# Altium schematic sheet GD_Tcontroller.SchDoc
size A4
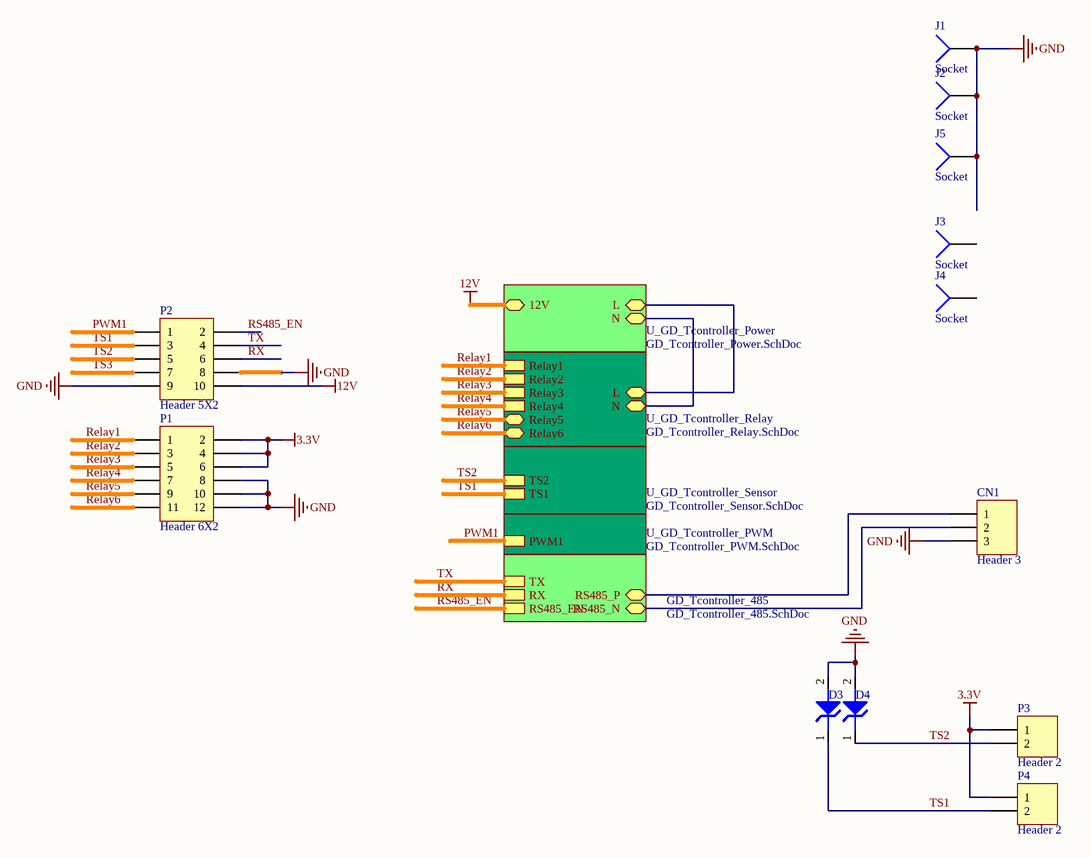
[diagram p0: GD_Tcontroller.SchDoc]

## Parts
CN1  Header 3  [HT5.08-3P-H]
D3  SMAJ5.0A  [SMA]  (value not drawn)
D4  SMAJ5.0A  [SMA]  (value not drawn)
J1  Socket  [SCREWFG3_2]
J2  Socket  [SCREWFG3_2]
J3  Socket  [SCREWFG3_2]
J4  Socket  [SCREWFG3_2]
J5  Socket  [SCREWFG3_2]
P1  Header 6X2  [DC3-12P]
P2  Header 5X2  [DC3-10P]
P3  Header 2  [PH2.0-2P-H]
P4  Header 2  [PH2.0-2P-H]

## Sub-sheets
GD_Tcontroller_485 = GD_Tcontroller_485.SchDoc: RS485_EN, TX, RX, RS485_P, RS485_N
U_GD_Tcontroller_Power = GD_Tcontroller_Power.SchDoc: N, L, 12V
U_GD_Tcontroller_PWM = GD_Tcontroller_PWM.SchDoc: PWM1
U_GD_Tcontroller_Relay = GD_Tcontroller_Relay.SchDoc: Relay1, Relay2, Relay3, Relay4, Relay5, Relay6, L, N
U_GD_Tcontroller_Sensor = GD_Tcontroller_Sensor.SchDoc: TS1, TS2

## Nets
3.3V: P1.2 P1.4 P1.6 P3.1 P4.1
12V: P2.10 ; sheet U_GD_Tcontroller_Power/12V
GND: CN1.3 D3.2 D4.2 J1.1 J2.1 J5.1 P1.8 P1.10 P1.12 P2.8 P2.9
PWM1: P2.1 ; sheet U_GD_Tcontroller_PWM/PWM1
Relay1: P1.1 ; sheet U_GD_Tcontroller_Relay/Relay1
Relay2: P1.3 ; sheet U_GD_Tcontroller_Relay/Relay2
Relay3: P1.5 ; sheet U_GD_Tcontroller_Relay/Relay3
Relay4: P1.7 ; sheet U_GD_Tcontroller_Relay/Relay4
Relay5: P1.9 ; sheet U_GD_Tcontroller_Relay/Relay5
Relay6: P1.11 ; sheet U_GD_Tcontroller_Relay/Relay6
RS485_EN: P2.2 ; sheet GD_Tcontroller_485/RS485_EN
RX: P2.6 ; sheet GD_Tcontroller_485/RX
TS1: D3.1 P2.3 P4.2 ; sheet U_GD_Tcontroller_Sensor/TS1
TS2: D4.1 P2.5 P3.2 ; sheet U_GD_Tcontroller_Sensor/TS2
TS3: P2.7
TX: P2.4 ; sheet GD_Tcontroller_485/TX
NetCN1_1: CN1.1 ; sheet GD_Tcontroller_485/RS485_P
NetCN1_2: CN1.2 ; sheet GD_Tcontroller_485/RS485_N
(unnamed): sheet U_GD_Tcontroller_Relay/L, sheet U_GD_Tcontroller_Power/L
(unnamed): sheet U_GD_Tcontroller_Relay/N, sheet U_GD_Tcontroller_Power/N

Not connected (* = marked no-connect by the designer): J3 1; J4 1

## Library data of the parts
CN1 = Header 3: Header, 3-Pin; LatestRevisionDate: 17-Jul-2002; LatestRevisionNote: Re-released for DXP Platform.; Publisher: Altium Limited
D3 D4 = ED00032: Manufacturer P/N: SMBJ15A; Manufacturer: Bourns; P/N: EE00002; Value: SMBJ15A; Type: ****
P1 = Header 6X2: Header, 6-Pin, Dual row; LatestRevisionDate: 17-Jul-2002; LatestRevisionNote: Re-released for DXP Platform.; Publisher: Altium Limited
P2 = Header 5X2: Header, 5-Pin, Dual row; LatestRevisionDate: 17-Jul-2002; LatestRevisionNote: Re-released for DXP Platform.; Publisher: Altium Limited
P3 P4 = Header 2: Header, 2-Pin; LatestRevisionDate: 17-Jul-2002; LatestRevisionNote: Re-released for DXP Platform.; Publisher: Altium Limited
J1-J5 = Socket: LatestRevisionDate: 17-Jul-2002; LatestRevisionNote: Re-released for DXP Platform.; Publisher: Altium Limited